# Altium schematic sheet G3-Sensor.SchDoc
size A2; Author: Bohao Chu; DrawnBy: Bohao Chu; SheetNumber: 3; SheetTotal: 4
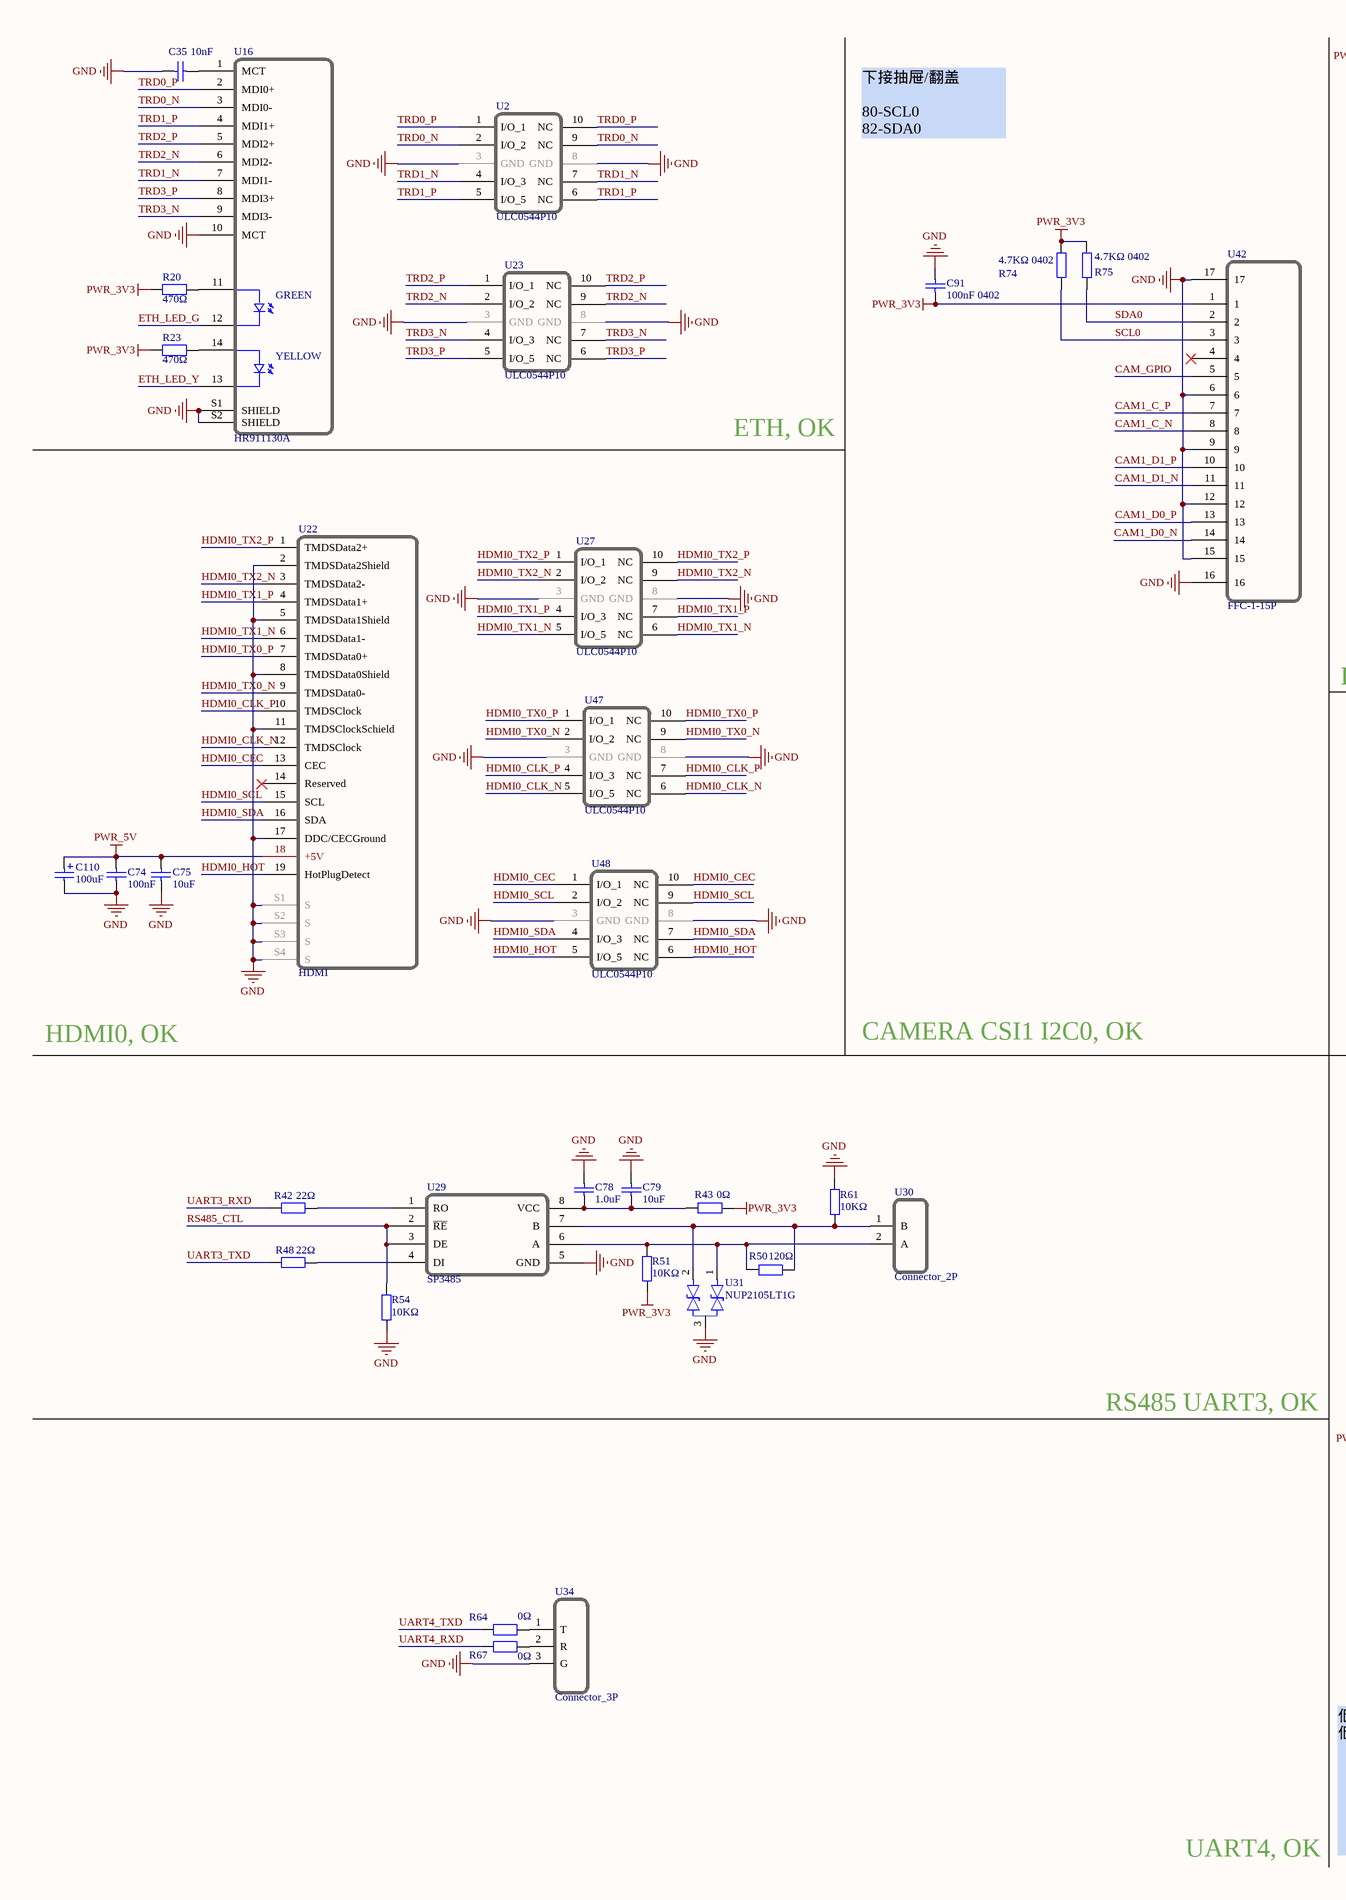
[diagram p0: G3-Sensor.SchDoc, left]
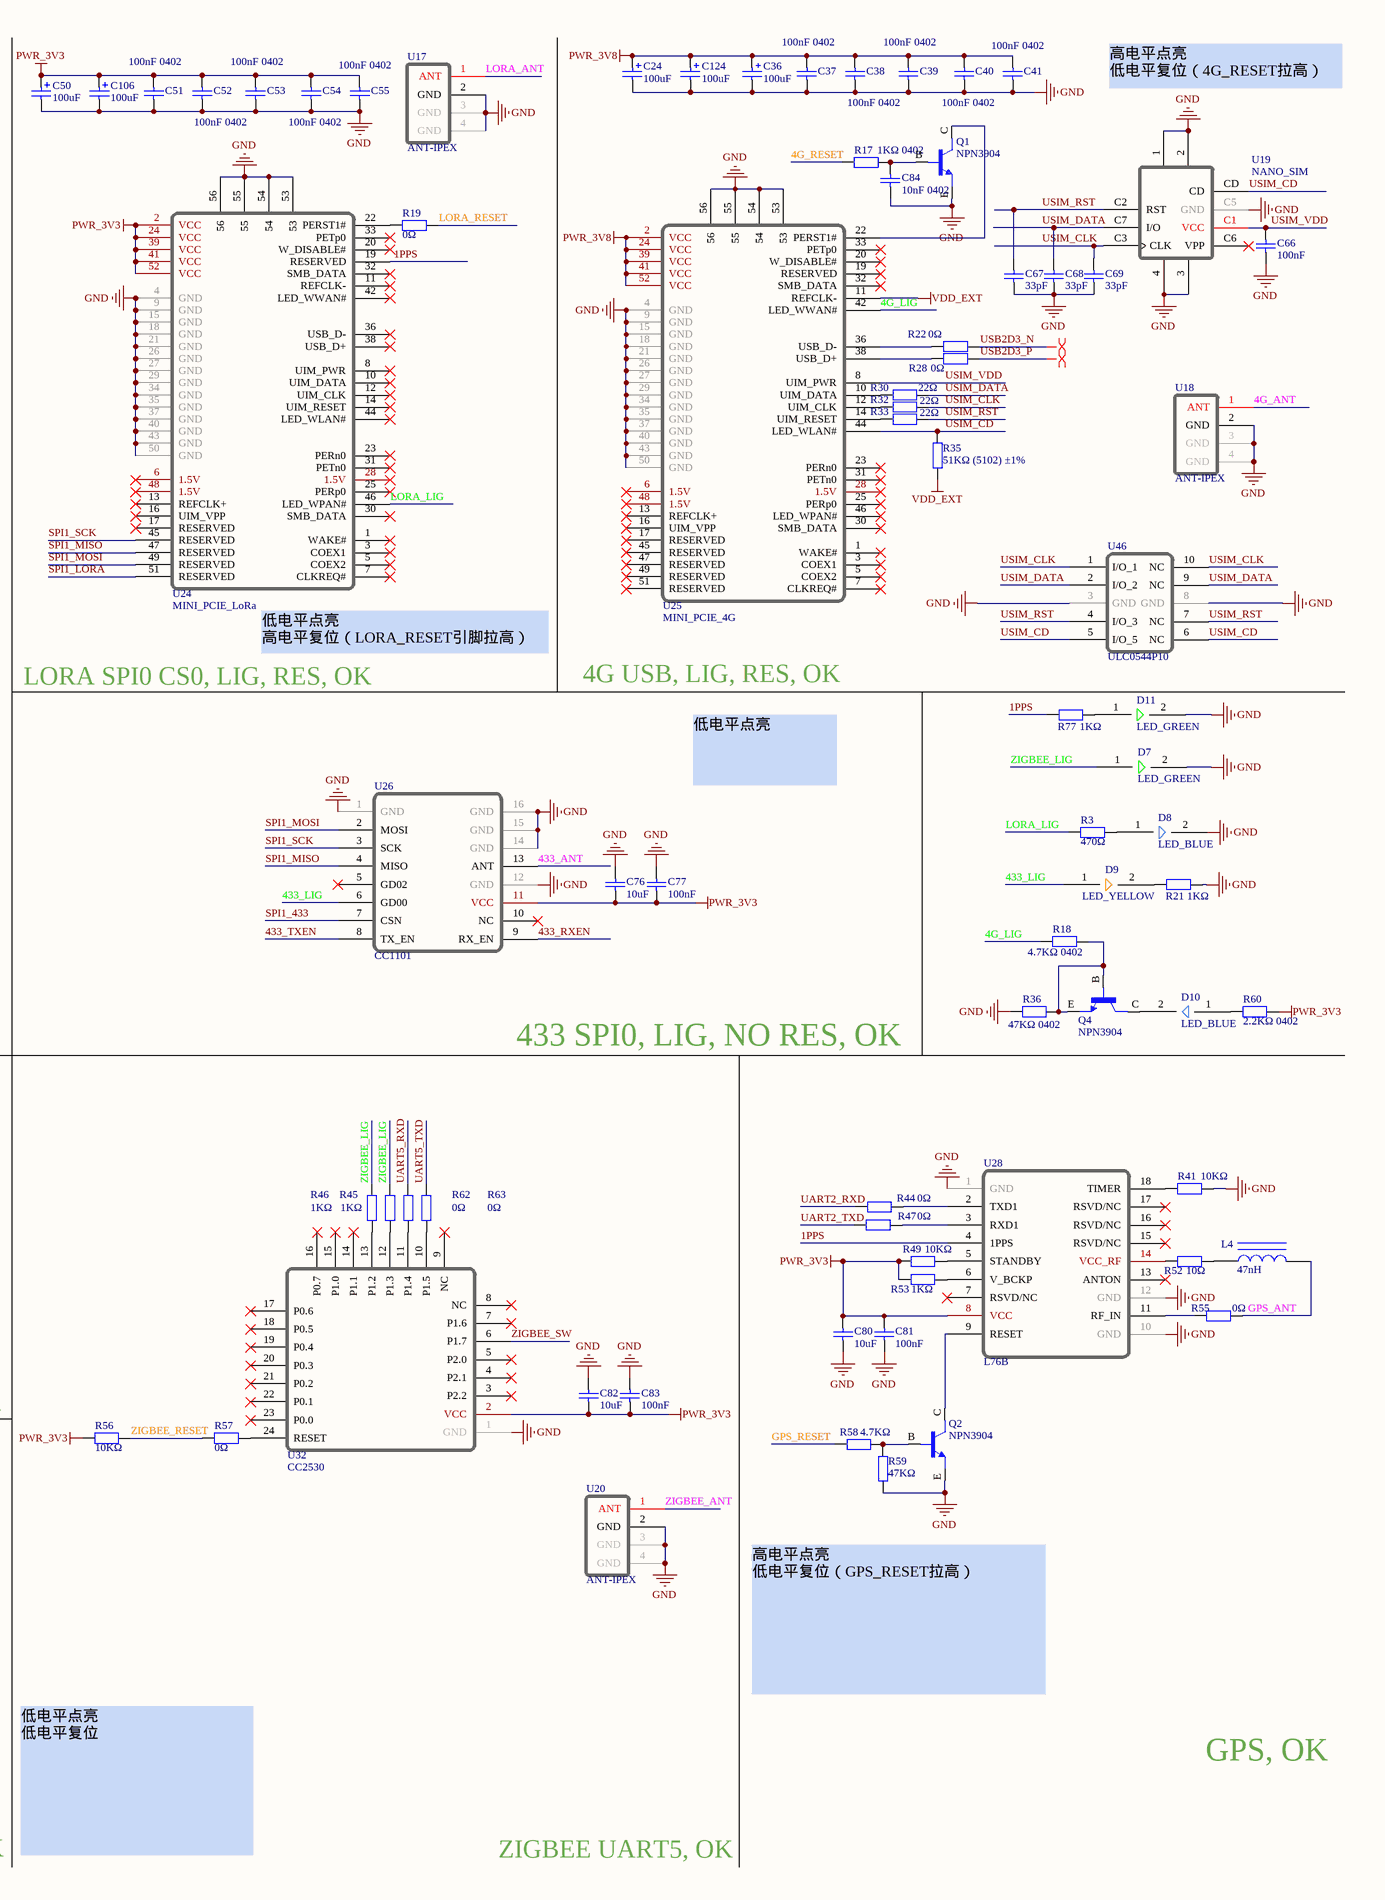
[diagram p1: G3-Sensor.SchDoc, right]

## Parts
C24  100uF  [CASE-B_3528]
C35  10nF  [0402_C]
C36  100uF  [CASE-B_3528]
C37  100nF 0402  [0402_C]
C38  100nF 0402  [0402_C]
C39  100nF 0402  [0402_C]
C40  100nF 0402  [0402_C]
C41  100nF 0402  [0402_C]
C50  100uF  [CASE-B_3528]
C51  100nF 0402  [0402_C]
C52  100nF 0402  [0402_C]
C53  100nF 0402  [0402_C]
C54  100nF 0402  [0402_C]
C55  100nF 0402  [0402_C]
C66  100nF  [0402_C]
C67  33pF  [0402_C]
C68  33pF  [0402_C]
C69  33pF  [0402_C]
C74  100nF  [0402_C]
C75  10uF  [0402_C]
C76  10uF  [0402_C]
C77  100nF  [0402_C]
C78  1.0uF  [0402_C]
C79  10uF  [0402_C]
C80  10uF  [0402_C]
C81  100nF  [0402_C]
C82  10uF  [0402_C]
C83  100nF  [0402_C]
C84  10nF 0402  [0402_C]
C91  100nF 0402  [0402_C]
C106  100uF  [CASE-B_3528]
C110  100uF  [CASE-B_3528]
C124  100uF  [CASE-B_3528]
D7  LED_GREEN  [LED_SIDE]
D8  LED_BLUE  [LED_SIDE]
D9  LED_YELLOW  [LED_SIDE]
D10  LED_BLUE  [LED_SIDE]
D11  LED_GREEN  [LED_SIDE]
L4  47nH  [0603_L]
Q1  NPN3904  [NPN3904]
Q2  NPN3904  [NPN3904]
Q4  NPN3904  [NPN3904]
R3  470Ω  [0402_R]
R17  1KΩ 0402  [0402_R]
R18  4.7KΩ 0402  [0402_R]
R19  0Ω  [0402_R]
R20  470Ω  [0402_R]
R21  1KΩ  [0402_R]
R22  0Ω  [0402_R]
R23  470Ω  [0402_R]
R28  0Ω  [0402_R]
R30  22Ω  [0402_R]
R32  22Ω  [0402_R]
R33  22Ω  [0402_R]
R35  51KΩ (5102) ±1%  [0402_R]
R36  47KΩ 0402  [0402_R]
R41  10KΩ  [0402_R]
R42  22Ω  [0402_R]
R43  0Ω  [0402_R]
R44  0Ω  [0402_R]
R45  1KΩ  [0402_R]
R46  1KΩ  [0402_R]
R47  0Ω  [0402_R]
R48  22Ω  [0402_R]
R49  10KΩ  [0402_R]
R50  120Ω  [0402_R]
R51  10KΩ  [0402_R]
R52  10Ω  [0402_R]
R53  1KΩ  [0402_R]
R54  10KΩ  [0402_R]
R55  0Ω  [0402_R]
R56  10KΩ  [0402_R]
R57  0Ω  [0402_R]
R58  4.7KΩ  [0402_R]
R59  47KΩ  [0402_R]
R60  2.2KΩ 0402  [0402_R]
R61  10KΩ  [0402_R]
R62  0Ω  [0402_R]
R63  0Ω  [0402_R]
R64  0Ω  [0402_R]
R67  0Ω  [0402_R]
R74  4.7KΩ 0402  [0402_R]
R75  4.7KΩ 0402  [0402_R]
R77  1KΩ  [0402_R]
U2  ULC0544P10  [ULC0544P10]
U16  HR911130A  [HR911130A]
U17  ANT-IPEX  [ANT-IPEX]
U18  ANT-IPEX  [ANT-IPEX]
U19  NANO_SIM  [NANO_SIM]
U20  ANT-IPEX  [ANT-IPEX]
U22  HDMI  [HDMI]
U23  ULC0544P10  [ULC0544P10]
U24  MINI_PCIE_LoRa  [MINI-PCIE]
U25  MINI_PCIE_4G  [MINI-PCIE]
U26  CC1101  [CC1101]
U27  ULC0544P10  [ULC0544P10]
U28  L76B  [L76B]
U29  SP3485  [SP3485]
U30  Connector_2P  [CONNECTOR_2P]
U31  NUP2105LT1G  [NUP2105LT1G]
U32  CC2530  [CC2530]
U34  Connector_3P  [CONNECTOR_3P]
U42  FFC-1-15P  [FFC-1-15P]
U46  ULC0544P10  [ULC0544P10]
U47  ULC0544P10  [ULC0544P10]
U48  ULC0544P10  [ULC0544P10]

## Nets
GND: C24.2 C35.1 C36.2 C37.1 C38.1 C39.1 C40.1 C41.1 C50.2 C51.1 C52.1 C53.1 C54.1 C55.1 C66.1 C67.1 C68.1 C69.1 C74.1 C75.1 C76.2 C77.2 C78.2 C79.2 C80.1 C81.1 C82.2 C83.2 C84.1 C91.2 C106.2 C110.2 C124.2 D7.2 D8.2 D11.2 Q1.E Q2.E R21.2 R36.1 R41.2 R54.1 R59.1 R61.2 U2.3(GND) U2.8(GND) U16.10(MCT) U16.S1(SHIELD) U16.S2(SHIELD) U17.2(GND) U17.3(GND) U17.4(GND) U18.2(GND) U18.3(GND) U18.4(GND) U19.1 U19.2 U19.3 U19.4 U19.C5(GND) U20.2(GND) U20.3(GND) U20.4(GND) U22.2(TMDSData2Shield) U22.5(TMDSData1Shield) U22.8(TMDSData0Shield) U22.11(TMDSClockSchield) U22.17(DDC/CECGround) U22.S1(S) U22.S2(S) U22.S3(S) U22.S4(S) U23.3(GND) U23.8(GND) U24.4(GND) U24.9(GND) U24.15(GND) U24.18(GND) U24.21(GND) U24.26(GND) U24.27(GND) U24.29(GND) U24.34(GND) U24.35(GND) U24.37(GND) U24.40(GND) U24.43(GND) U24.50(GND) U24.53 U24.54 U24.55 U24.56 U25.4(GND) U25.9(GND) U25.15(GND) U25.18(GND) U25.21(GND) U25.26(GND) U25.27(GND) U25.29(GND) U25.34(GND) U25.35(GND) U25.37(GND) U25.40(GND) U25.43(GND) U25.50(GND) U25.53 U25.54 U25.55 U25.56 U26.1(GND) U26.12(GND) U26.14(GND) U26.15(GND) U26.16(GND) U27.3(GND) U27.8(GND) U28.1(GND) U28.10(GND) U28.12(GND) U29.5(GND) U31.3 U32.1(GND) U34.3(G) U42.6 U42.9 U42.12 U42.15 U42.16 U42.17 U46.3(GND) U46.8(GND) U47.3(GND) U47.8(GND) U48.3(GND) U48.8(GND)
PWR_3V3: C50.1 C51.2 C52.2 C53.2 C54.2 C55.2 C76.1 C77.1 C80.2 C81.2 C82.1 C83.1 C91.1 C106.1 R20.1 R23.1 R43.2 R49.1 R51.1 R53.1 R56.1 R60.2 R74.2 R75.2 U24.2(VCC) U24.24(VCC) U24.39(VCC) U24.41(VCC) U24.52(VCC) U26.11(VCC) U28.8(VCC) U32.2(VCC) U42.1
PWR_3V8: C24.1 C36.1 C37.2 C38.2 C39.2 C40.2 C41.2 C124.1 U25.2(VCC) U25.24(VCC) U25.39(VCC) U25.41(VCC) U25.52(VCC)
PWR_5V: C74.2 C75.2 C110.1 U22.18(+5V)
VDD_EXT: R35.1 U25.11(REFCLK-)
1PPS: R77.1 U24.19(RESERVED) U28.4(1PPS)
4G_ANT: U18.1(ANT)
4G_LIG: R18.1 U25.42(LED_WWAN#)
4G_RESET: R17.1
433_ANT: U26.13(ANT)
433_LIG: D9.1 U26.6(GD00)
433_RXEN: U26.9(RX_EN)
433_TXEN: U26.8(TX_EN)
CAM1_C_N: U42.8
CAM1_C_P: U42.7
CAM1_D0_N: U42.14
CAM1_D0_P: U42.13
CAM1_D1_N: U42.11
CAM1_D1_P: U42.10
CAM_GPIO: U42.5
ETH_LED_G: U16.12
ETH_LED_Y: U16.13
GPS_ANT: L4.2 R55.2
GPS_RESET: R58.1
HDMI0_CEC: U22.13(CEC) U48.1(I/O_1) U48.10(NC)
HDMI0_CLK_N: U22.12(TMDSClock) U47.5(I/O_5) U47.6(NC)
HDMI0_CLK_P: U22.10(TMDSClock) U47.4(I/O_3) U47.7(NC)
HDMI0_HOT: U22.19(HotPlugDetect) U48.5(I/O_5) U48.6(NC)
HDMI0_SCL: U22.15(SCL) U48.2(I/O_2) U48.9(NC)
HDMI0_SDA: U22.16(SDA) U48.4(I/O_3) U48.7(NC)
HDMI0_TX0_N: U22.9(TMDSData0-) U47.2(I/O_2) U47.9(NC)
HDMI0_TX0_P: U22.7(TMDSData0+) U47.1(I/O_1) U47.10(NC)
HDMI0_TX1_N: U22.6(TMDSData1-) U27.5(I/O_5) U27.6(NC)
HDMI0_TX1_P: U22.4(TMDSData1+) U27.4(I/O_3) U27.7(NC)
HDMI0_TX2_N: U22.3(TMDSData2-) U27.2(I/O_2) U27.9(NC)
HDMI0_TX2_P: U22.1(TMDSData2+) U27.1(I/O_1) U27.10(NC)
LORA_ANT: U17.1(ANT)
LORA_LIG: R3.1 U24.46(LED_WPAN#)
LORA_RESET: R19.1
RS485_CTL: R54.2 U29.2(~{RE}) U29.3(DE)
SCL0: R74.1 U42.3
SDA0: R75.1 U42.2
SPI1_433: U26.7(CSN)
SPI1_LORA: U24.51(RESERVED)
SPI1_MISO: U24.47(RESERVED) U26.4(MISO)
SPI1_MOSI: U24.49(RESERVED) U26.2(MOSI)
SPI1_SCK: U24.45(RESERVED) U26.3(SCK)
TRD0_N: U2.2(I/O_2) U2.9(NC) U16.3(MDI0-)
TRD0_P: U2.1(I/O_1) U2.10(NC) U16.2(MDI0+)
TRD1_N: U2.4(I/O_3) U2.7(NC) U16.7(MDI1-)
TRD1_P: U2.5(I/O_5) U2.6(NC) U16.4(MDI1+)
TRD2_N: U16.6(MDI2-) U23.2(I/O_2) U23.9(NC)
TRD2_P: U16.5(MDI2+) U23.1(I/O_1) U23.10(NC)
TRD3_N: U16.9(MDI3-) U23.4(I/O_3) U23.7(NC)
TRD3_P: U16.8(MDI3+) U23.5(I/O_5) U23.6(NC)
UART2_RXD: R44.1
UART2_TXD: R47.1
UART3_RXD: R42.1
UART3_TXD: R48.1
UART4_RXD: R67.2
UART4_TXD: R64.2
UART5_RXD: R62.2
UART5_TXD: R63.2
USB2D3_N: R22.1
USB2D3_P: R28.2
USIM_CD: R35.2 U19.CD U25.44(LED_WLAN#) U46.5(I/O_5) U46.6(NC)
USIM_CLK: C69.2 R32.2 U19.C3(CLK) U46.1(I/O_1) U46.10(NC)
USIM_DATA: C68.2 R30.2 U19.C7(I/O) U46.2(I/O_2) U46.9(NC)
USIM_RST: C67.2 R33.2 U19.C2(RST) U46.4(I/O_3) U46.7(NC)
USIM_VDD: C66.2 U19.C1(VCC) U25.8(UIM_PWR)
ZIGBEE_ANT: U20.1(ANT)
ZIGBEE_LIG: D7.1 R45.2 R46.2
ZIGBEE_RESET: R56.2 R57.2
ZIGBEE_SW: U32.6(P1.7)
NetC35_2: C35.2 U16.1(MCT)
NetC78_1: C78.1 C79.1 R43.1 U29.8(VCC)
NetC84_2: C84.2 Q1.B R17.2
NetD8_1: D8.1 R3.2
NetD9_2: D9.2 R21.1
NetD10_1: D10.1 R60.1
NetD10_2: D10.2 Q4.C
NetD11_1: D11.1 R77.2
NetL4_1: L4.1 R52.2
NetQ1_C: Q1.C U25.22(PERST1#)
NetQ2_B: Q2.B R58.2 R59.2
NetQ2_C: Q2.C U28.9(RESET)
NetQ4_B: Q4.B Q4.E R18.2 R36.2
NetR19_2: R19.2 U24.22(PERST1#)
NetR20_2: R20.2 U16.11
NetR22_2: R22.2 U25.36(USB_D-)
NetR23_2: R23.2 U16.14
NetR28_1: R28.1 U25.38(USB_D+)
NetR30_1: R30.1 U25.10(UIM_DATA)
NetR32_1: R32.1 U25.12(UIM_CLK)
NetR33_1: R33.1 U25.14(UIM_RESET)
NetR41_1: R41.1 U28.18(TIMER)
NetR42_2: R42.2 U29.1(RO)
NetR44_2: R44.2 U28.2(TXD1)
NetR45_1: R45.1 U32.12(P1.3)
NetR46_1: R46.1 U32.13(P1.2)
NetR47_2: R47.2 U28.3(RXD1)
NetR48_2: R48.2 U29.4(DI)
NetR49_2: R49.2 U28.5(STANDBY)
NetR50_1: R50.1 R61.1 U29.7(B) U30.1(B) U31.2
NetR50_2: R50.2 R51.2 U29.6(A) U30.2(A) U31.1
NetR52_1: R52.1 U28.14(VCC_RF)
NetR53_2: R53.2 U28.6(V_BCKP)
NetR55_1: R55.1 U28.11(RF_IN)
NetR57_1: R57.1 U32.24(RESET)
NetR62_1: R62.1 U32.11(P1.4)
NetR63_1: R63.1 U32.10(P1.5)
NetR64_1: R64.1 U34.1(T)
NetR67_1: R67.1 U34.2(R)

Not connected (* = marked no-connect by the designer): U19 C6(VPP)*; U22 14(Reserved)*; U24 1(WAKE#)* 3(COEX1)* 5(COEX2)* 6(1.5V)* 7(CLKREQ#)* 8(UIM_PWR)* 10(UIM_DATA)* 11(REFCLK-)* 12(UIM_CLK)* 13(REFCLK+)* 14(UIM_RESET)* 16(UIM_VPP)* 17(RESERVED)* 20(W_DISABLE#)* 23(PERn0)* 25(PERp0)* 28(1.5V)* 30(SMB_DATA)* 31(PETn0)* 32(SMB_DATA)* 33(PETp0)* 36(USB_D-)* 38(USB_D+)* 42(LED_WWAN#)* 44(LED_WLAN#)* 48(1.5V)*; U25 1(WAKE#)* 3(COEX1)* 5(COEX2)* 6(1.5V)* 7(CLKREQ#)* 13(REFCLK+)* 16(UIM_VPP)* 17(RESERVED)* 19(RESERVED)* 20(W_DISABLE#)* 23(PERn0)* 25(PERp0)* 28(1.5V)* 30(SMB_DATA)* 31(PETn0)* 32(SMB_DATA)* 33(PETp0)* 45(RESERVED)* 46(LED_WPAN#)* 47(RESERVED)* 48(1.5V)* 49(RESERVED)* 51(RESERVED)*; U26 5(GD02)* 10(NC)*; U28 7(RSVD/NC)* 13(ANTON)* 15(RSVD/NC)* 16(RSVD/NC)* 17(RSVD/NC)*; U32 3(P2.2)* 4(P2.1)* 5(P2.0)* 7(P1.6)* 8(NC)* 9(NC)* 14(P1.1)* 15(P1.0)* 16(P0.7)* 17(P0.6)* 18(P0.5)* 19(P0.4)* 20(P0.3)* 21(P0.2)* 22(P0.1)* 23(P0.0)*; U42 4*

## Layout directives
differential pair: USB2D3_N, USB2D3_P

## Notes on the sheet
- 高电平点亮
  低电平复位（4G_RESET拉高）
- 下接抽屉/翻盖
  80-SCL0
  82-SDA0
- ETH, OK
- (near U24) 低电平点亮
  高电平复位（LORA_RESET引脚拉高）
- LORA SPI0 CS0, LIG, RES, OK
- 4G USB, LIG, RES, OK
- 低电平点亮
- HDMI0, OK
- CAMERA CSI1 I2C0, OK
- 433 SPI0, LIG, NO RES, OK
- RS485 UART3, OK
- 高电平点亮
  低电平复位（GPS_RESET拉高）
- GPS, OK
- UART4, OK
- 低电平点亮
  低电平复位
- ZIGBEE UART5, OK
- (in symbol HR911130A) GREEN; YELLOW

## Library data of the parts
C24 C36 C50 C106 C110 C124 = 3528 100uF (107) 10% 6.3V: 钽电容; ComponentLink1Description: 供应商链接; ComponentLink1URL: http://www.szlcsc.com/product/details_16815.html; Package: 3528; Supplier: LC; SuppliersPartNumber: C16133
C35 C84 = 0402 10nF (103) 10% 50V: 贴片电容; ComponentLink1Description: 供应商链接; ComponentLink1URL: http://www.szlcsc.com/product/details_15869.html; Package: 0402; Supplier: LC; SuppliersPartNumber: C15195
C37-C41 C51-C55 C66 C74 C77 C81 C83 C91 = 0402 100nF (104) 10% 16V: 贴片电容; ComponentLink1Description: 供应商链接; ComponentLink1URL: http://www.szlcsc.com/product/details_1877.html; Package: 0402; Supplier: LC; SuppliersPartNumber: C1525
C67-C69 = 0402 33pF (330) 5% 50V: 贴片电容; ComponentLink1Description: 供应商链接; ComponentLink1URL: http://www.szlcsc.com/product/details_1914.html; Package: 0402; Supplier: LC; SuppliersPartNumber: C1562
C75 C76 C79 C80 C82 = 0402 10uF (106) 20% 6.3V: 贴片电容; ComponentLink1Description: 供应商链接; ComponentLink1URL: http://www.szlcsc.com/product/details_16204.html; Package: 0402; Supplier: LC; SuppliersPartNumber: C15525
C78 = 0402 1.0uF (105) 10% 25V: 贴片电容; ComponentLink1Description: 供应商链接; ComponentLink1URL: http://www.szlcsc.com/product/details_53938.html; Package: 0402; Supplier: LC; SuppliersPartNumber: C52923
D7 D11 = LED_GREEN: LED GREEN 0603 SIDE
D8 D10 = LED_BLUE: LED BLUE 0603 SIDE
D9 = LED_YELLOW: LED YELLOW 0603 SIDE
L4 = 0603 47nH: 贴片电感; ComponentLink1Description: 供应商链接; ComponentLink1URL: http://www.szlcsc.com/product/details_30437.html; Package: 0603; Supplier: LC; SuppliersPartNumber: C29683
Q1 Q2 Q4 = NPN3904: NPN 40V 200mA 300MHz 300mW Surface; MF: ON Semiconductor; MP: MMBT3904LT1G; Value: *; Package: SOT-23-3 NXP Semiconductors; SnapEDA_Link: https://www.snapeda.com/parts/MMBT3904LT1G/ON%20Semiconductor/view-part/587490/?ref=snap; Price: None; Availability: Unavailable
R3 R20 R23 = 0402 470Ω (4700) 1%: 贴片电阻; ComponentLink1Description: 供应商链接; ComponentLink1URL: http://www.szlcsc.com/product/details_25860.html; Package: 0402; Supplier: LC; SuppliersPartNumber: C25117
R17 R21 R45 R46 R53 R77 = 0402 1KΩ (1001) 1%: 贴片电阻; ComponentLink1Description: 供应商链接; ComponentLink1URL: http://www.szlcsc.com/product/details_12256.html; Package: 0402; Supplier: LC; SuppliersPartNumber: C11702
R18 R58 R74 R75 = 0402 4.7KΩ (4701) 1%: 贴片电阻; ComponentLink1Description: 供应商链接; ComponentLink1URL: http://www.szlcsc.com/product/details_26643.html; Package: 0402; Supplier: LC; SuppliersPartNumber: C25900
R19 R22 R28 R43 R44 R47 R55 R57 R62-R64 R67 = 0402 0Ω (0R0) 1%: 贴片电阻; ComponentLink1Description: 供应商链接; ComponentLink1URL: http://www.szlcsc.com/product/details_17853.html; Package: 0402; Supplier: LC; SuppliersPartNumber: C17168
R30 R32 R33 R42 R48 = 0402 22Ω (22R0) 1%: 贴片电阻; ComponentLink1Description: 供应商链接; ComponentLink1URL: http://www.szlcsc.com/product/details_25835.html; Package: 0402; Supplier: LC; SuppliersPartNumber: C25092
R35 = 0402 51KΩ (5102) 1%: 贴片电阻; ComponentLink1Description: 供应商链接; ComponentLink1URL: http://www.szlcsc.com/product/details_26537.html; Package: 0402; Supplier: LC; SuppliersPartNumber: C25794
R36 R59 = 0402 47KΩ (4702) 1%: 贴片电阻; ComponentLink1Description: 供应商链接; ComponentLink1URL: http://www.szlcsc.com/product/details_26535.html; Package: 0402; Supplier: LC; SuppliersPartNumber: C25792
R41 R49 R51 R54 R56 R61 = 0402 10KΩ (1002) 1%: 贴片电阻; ComponentLink1Description: 供应商链接; ComponentLink1URL: http://www.szlcsc.com/product/details_26487.html; Package: 0402; Supplier: LC; SuppliersPartNumber: C25744
R50 = 0402 120Ω (1200) 1%: 贴片电阻; ComponentLink1Description: 供应商链接; ComponentLink1URL: http://www.szlcsc.com/product/details_25822.html; Package: 0402; Supplier: LC; SuppliersPartNumber: C25079
R52 = 0402 10Ω (10R0) 1%: 贴片电阻; ComponentLink1Description: 供应商链接; ComponentLink1URL: http://www.szlcsc.com/product/details_25820.html; Package: 0402; Supplier: LC; SuppliersPartNumber: C25077
R60 = 0402 2.2KΩ (2201) 1%: 贴片电阻; ComponentLink1Description: 供应商链接; ComponentLink1URL: http://www.szlcsc.com/product/details_26622.html; Package: 0402; Supplier: LC; SuppliersPartNumber: C25879
U2 U23 U27 U46-U48 = ULC0544P10: ESD
U16 = HR911130A: ETH RJ45
U17 U18 U20 = ANT-IPEX: ANT
U19 = NANO_SIM: 4G Card Slot
U24 U25 = MINI_PCIE: LoRa, 4G
U26 = CC1101: 433Mhz
U28 = L76B: GPS BEIDOU
U29 = SP3485: UART = RS485
U30 = Connector_2P: Connector for RS485, CAN
U32 = CC2530: ZigBee 2.4GHz
U34 = Connector_3P: Connector for UART
U42 = FFC-1-15P: 1.0MM 15PIN